# Altium project CCjammerRev0.PrjPCB
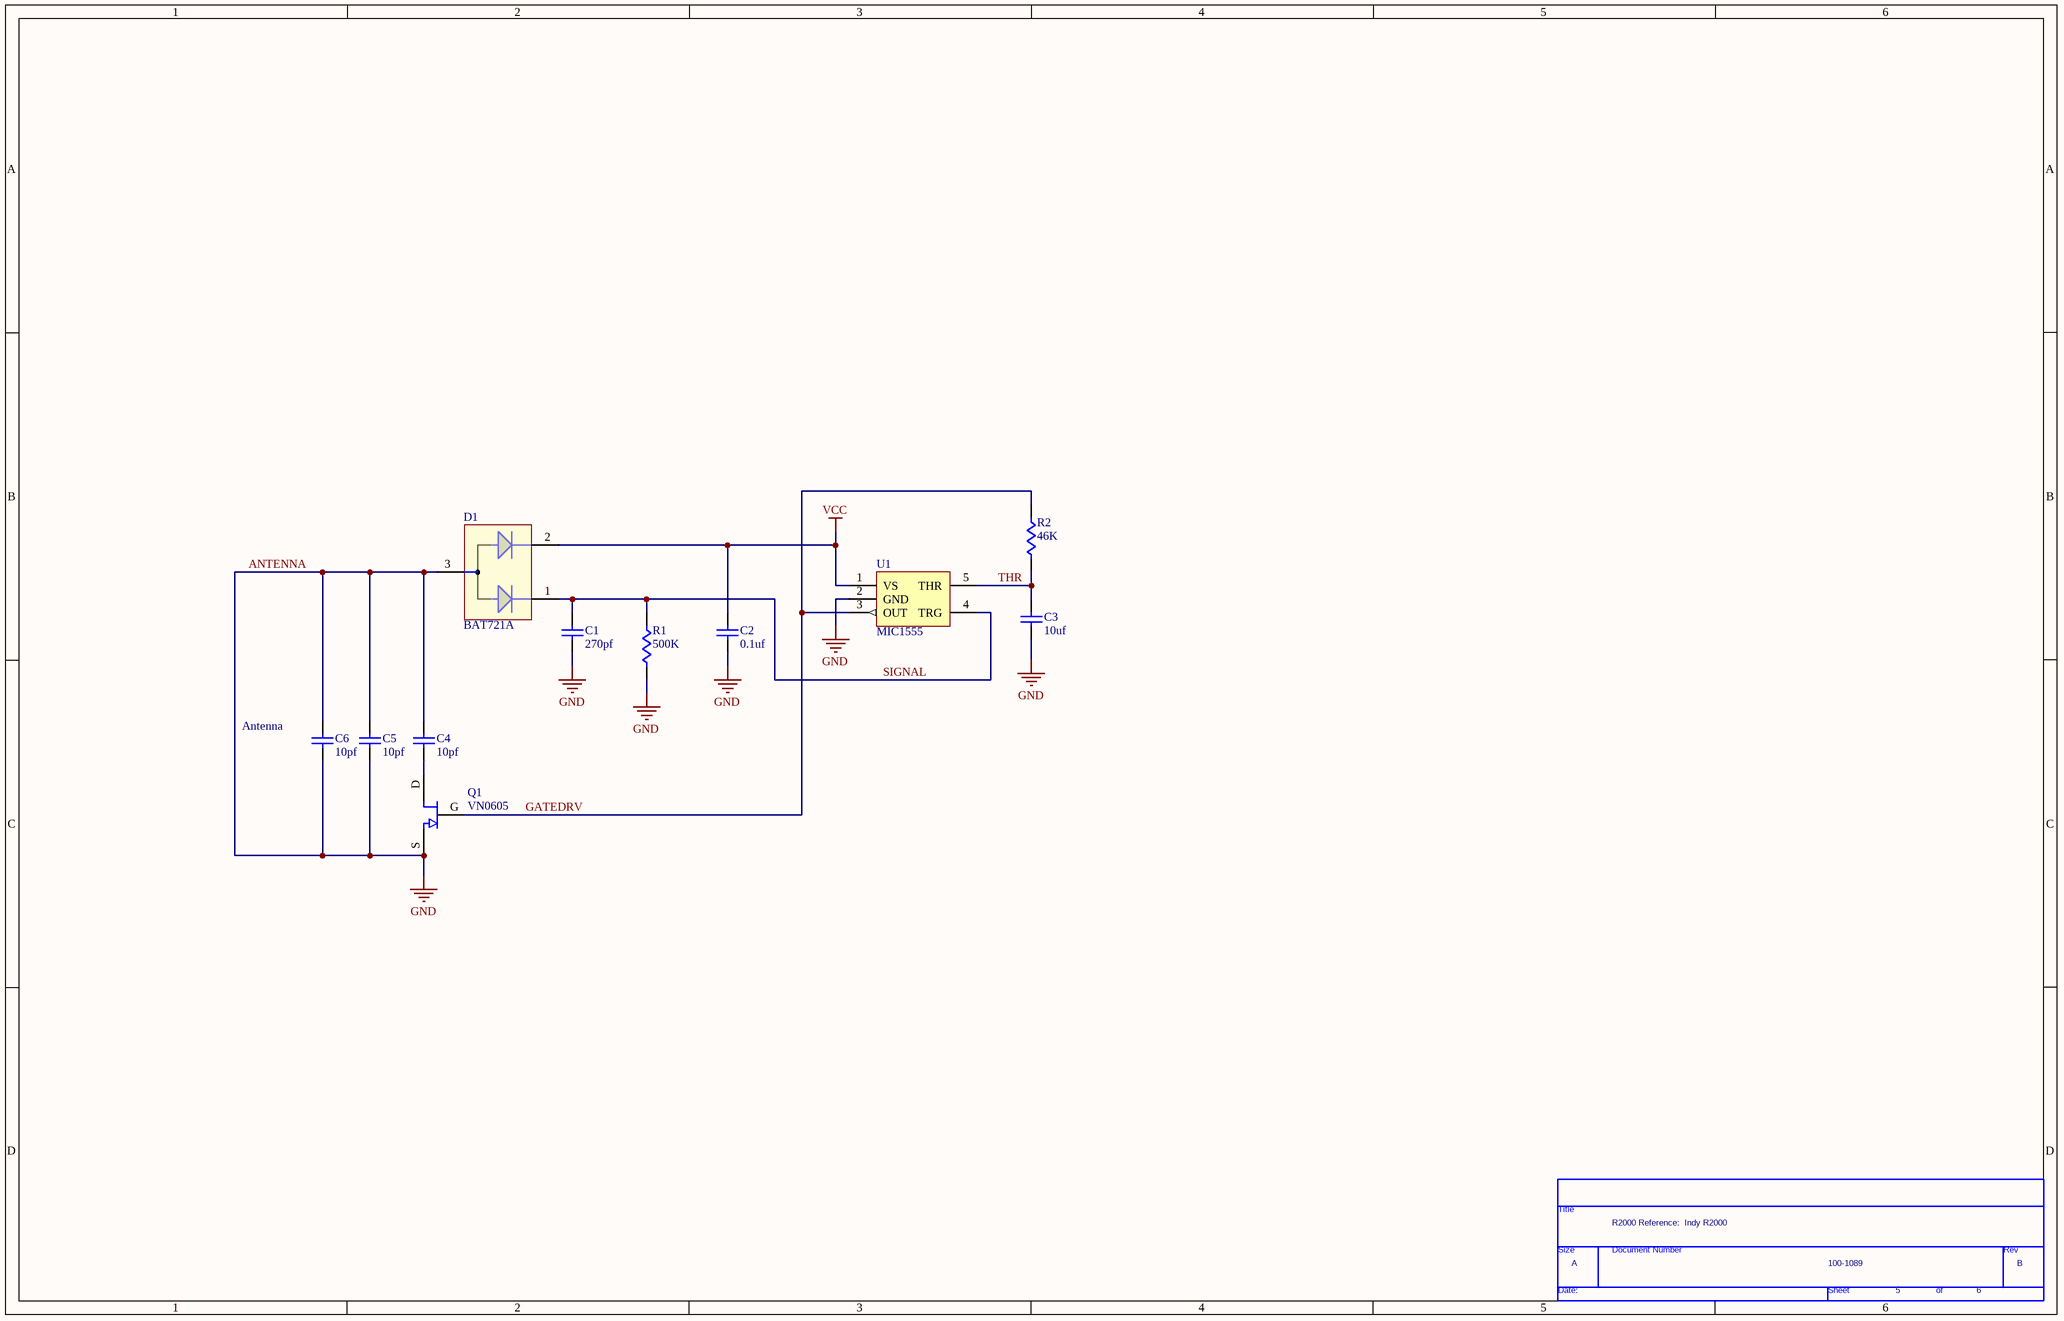
[diagram p0: CCjammerRev0_TOP.SchDoc]
1 sheet, 12 parts. Net scope: global (net labels, ports and power ports of the same name join across sheets).
Board file: CCjammerRev0.PcbDoc

## Sheet CCjammerRev0_TOP.SchDoc
size 386 x 246 mm

### Parts
*  Page Count: 6  Page Number: 5  Page Size: A  Title: R2000 Reference:  Indy R2000  RevCode: B  Doc: 100-1089  (hidden comment: TitleBlock0)  (graphical)
C1  270pf  [0603_072205]
C2  0.1uf  [0603_072205]
C3  10uf  [0603_072205]
C4  10pf  [0603_072205]
C5  10pf  [0603_072205]
C6  10pf  [0603_072205]
D1  BAT721A  [SOT23_012105]
Q1  VN0605  [SOT23 FET_012005]
R1  500K  [0603_072205]
R2  46K  [0603_072205]
U1  MIC1555  [SOT25_030205]

### Nets
ANTENNA: C1.1 C2.1 C3.1 C4.2 C5.1 C5.2 C6.1 C6.2 D1.3(AC) Q1.S R1.1 U1.2(GND)  [also labelled GND]
VCC: C2.2 D1.2 U1.1(VS)
GATEDRV: Q1.G R2.2 U1.3(OUT)
SIGNAL: C1.2 D1.1 R1.2 U1.4(TRG)
THR: C3.2 R2.1 U1.5(THR)
NetC4_1: C4.1 Q1.D

### Notes on the sheet
- (near C6) Antenna
- (in symbol TitleBlock0) Title; Size; Document Number; Rev; Date:; Sheet; of

### Library data of the parts
C1 C3-C6 = Cap: Capacitor
  C1: VALUE: 270pf
  C3: VALUE: 10uf
  C4-C6: VALUE: 10pf
C2 = Cap: Capacitor; PARTNO: TMK212BJ475KG-T; MAN: Taiyo Yuden; VALUE: 0.1uf; DK: 587-1782-1-ND
D1 = DIODE_DUAL_COM_AN_SOT23: PARTNO: BAT721A,215; MAN: NXP; VALUE: BAT721A; DK: 568-3418-1-ND
Q1 = FET N CHANNEL: PARTNO: VN0605T; MFG: Vishay; VALUE: VN0605; Mouser: 781-VN0605T
R1 R2 = RESISTOR: PARTNO: RES-0000
  R1: VALUE: 500K
  R2: VALUE: 46K
U1 = MIC1555: PARTNO: MIC1555YM5; MFG: Micrel; VALUE: MIC1555
* = TitleBlock0: Page Create Date: March  8, 1995